# EAGLE design E500 (EAGLE 9.5.1)
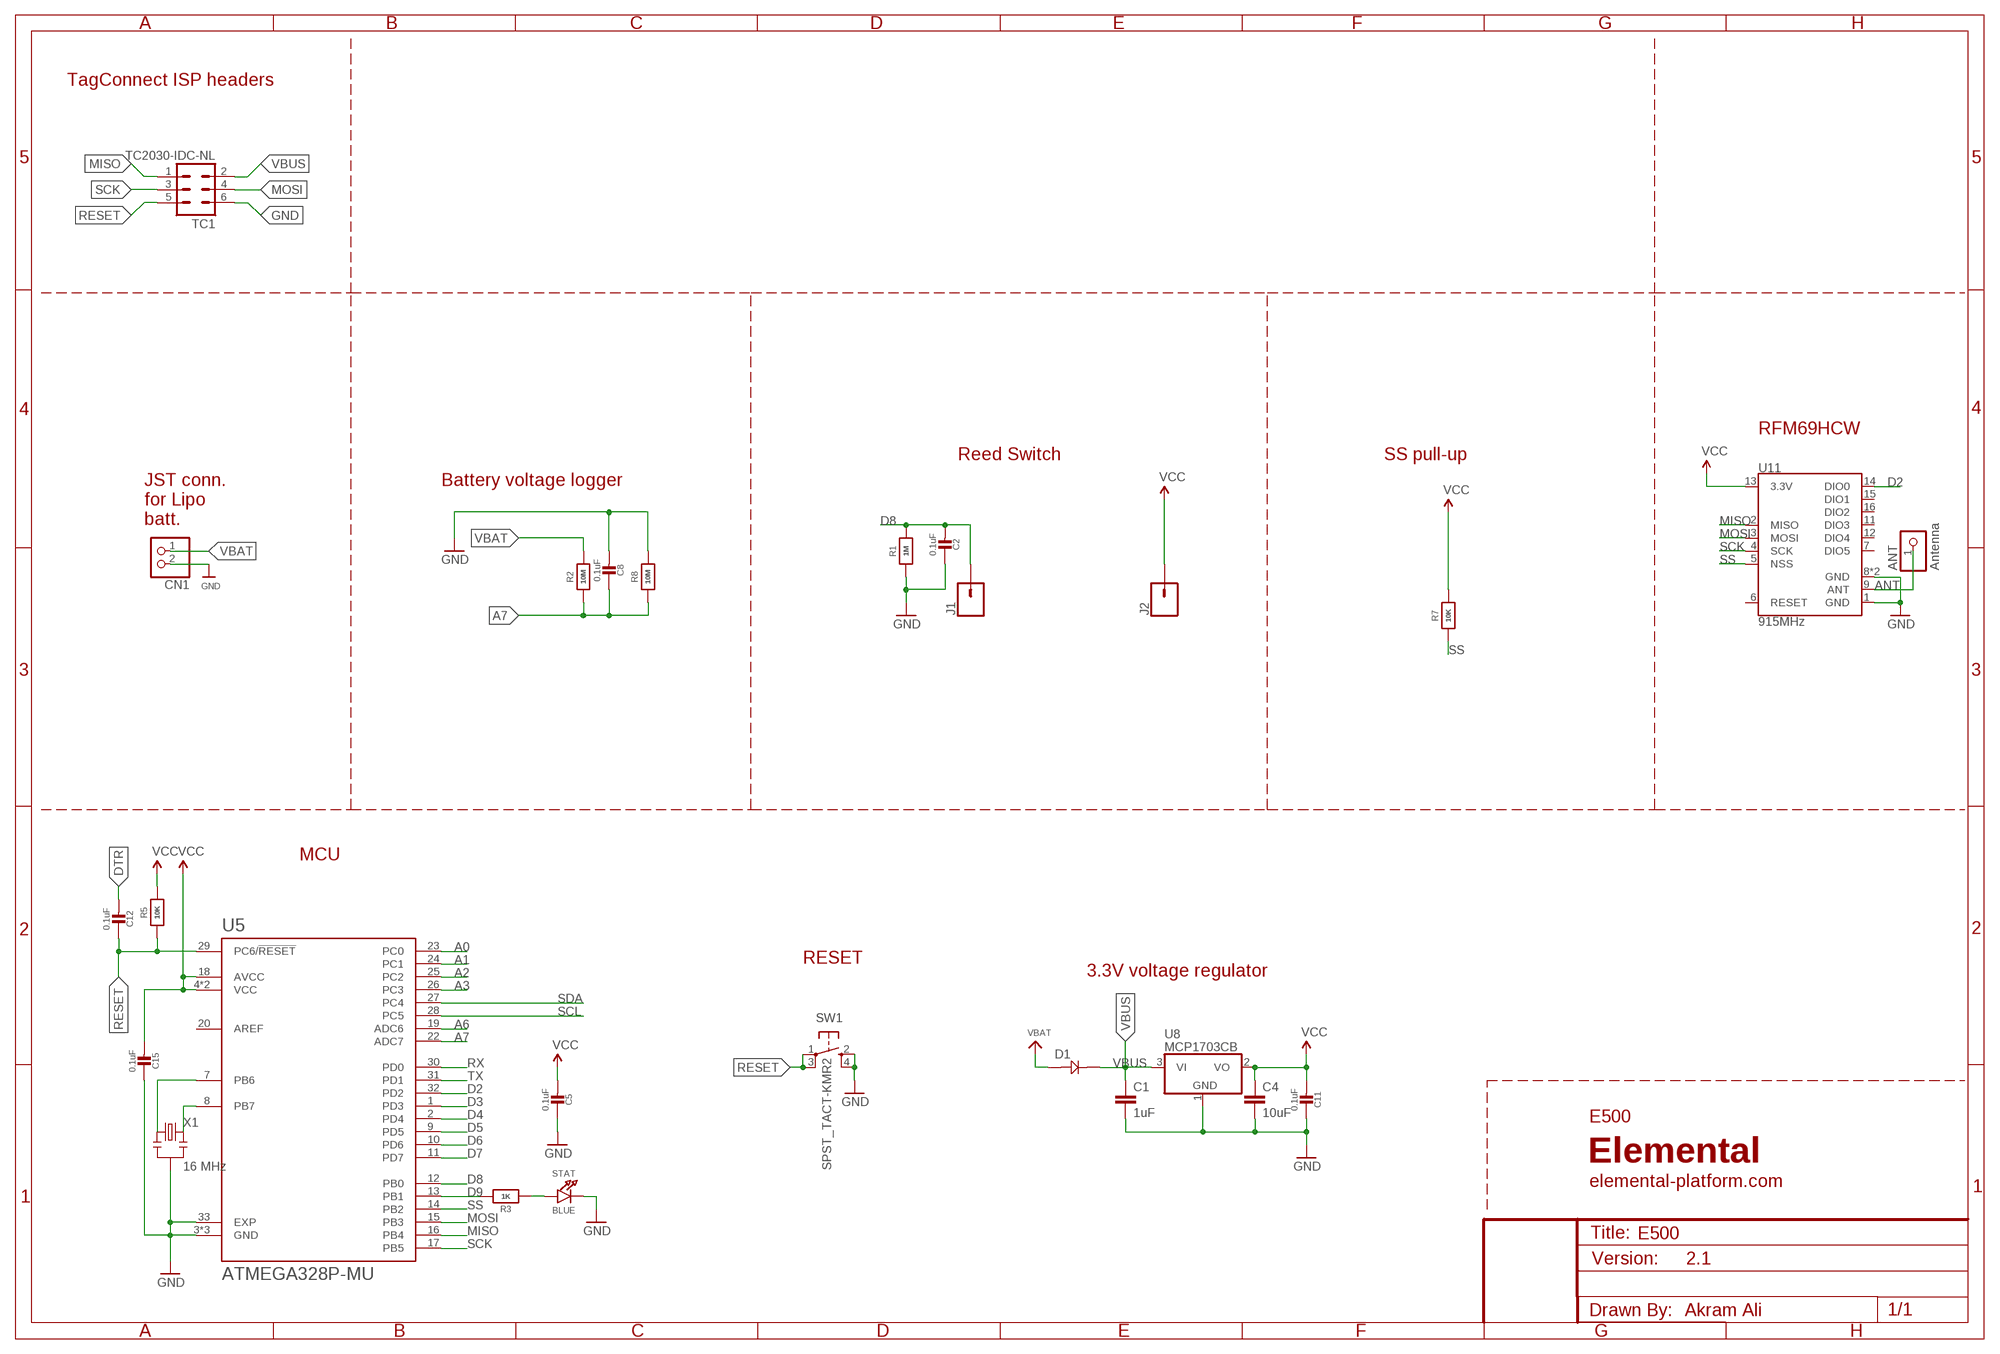
[diagram p0: schematic, sheet 1]

## Parts
ANT  Antenna  PINHD-1X1CB  [1X01-CLEANBIG]
C1  1uF  CAP0805  [0805]
C2  0.1uF  MICROBUILDER_CAP_CERAMIC_0402MP  [MICROBUILDER__0402MP]
C4  10uF  CAP0805  [0805]
C5  0.1uF  MICROBUILDER_CAP_CERAMIC_0402MP  [MICROBUILDER__0402MP]
C8  0.1uF  MICROBUILDER_CAP_CERAMIC_0402MP  [MICROBUILDER__0402MP]
C11  0.1uF  MICROBUILDER_CAP_CERAMIC_0402MP  [MICROBUILDER__0402MP]
C12  0.1uF  MICROBUILDER_CAP_CERAMIC_0402MP  [MICROBUILDER__0402MP]
C15  0.1uF  MICROBUILDER_CAP_CERAMIC_0402MP  [MICROBUILDER__0402MP]
CN1  JST_2PIN-SMT-RA  [JST-PH-2-SMT-RA]
D1  DIODE_SCHOTTKY0805-RES  [0805]
J1  CONN_01  [1X01]
J2  CONN_01  [1X01]
R1  1M  MICROBUILDER_RESISTOR_0402MP  [MICROBUILDER__0402MP]
R2  10M  MICROBUILDER_RESISTOR_0402MP  [MICROBUILDER__0402MP]
R3  1K  MICROBUILDER_RESISTOR_0402MP  [MICROBUILDER__0402MP]
R5  10K  MICROBUILDER_RESISTOR_0402MP  [MICROBUILDER__0402MP]
R7  10K  MICROBUILDER_RESISTOR_0402MP  [MICROBUILDER__0402MP]
R8  10M  MICROBUILDER_RESISTOR_0402MP  [MICROBUILDER__0402MP]
STAT  BLUE  LED0805_NOOUTLINE  [CHIPLED_0805_NOOUTLINE]
SW1  SPST_TACT-KMR2  [KMR2]
TC1  TC2030-IDC-NL  [TC2030-IDC-NL]
U5  ATMEGA328P-MU  [QFN50P500X500X100-33N]
U8  MCP1703CB  [SOT23]
U11  915MHz  RFM69HCW-915  [RFM69HCW-XXXS2]
X1  16 MHz  RESONATORSMD  [RESONATOR-SMD]

## Nets
A0: U5.23(PC0)
A1: U5.24(PC1)
A2: U5.25(PC2)
A3: U5.26(PC3)
A6: U5.19(ADC6)
A7: C8.1 R2.1 R8.1 U5.22(ADC7)
ANT: ANT.1 U11.9(ANT)
D2: U5.32(PD2) U11.14(DIO0)
D3: U5.1(PD3)
D4: U5.2(PD4)
D5: U5.9(PD5)
D6: U5.10(PD6)
D7: U5.11(PD7)
D8: C2.2 J1.1 R1.2 U5.12(PB0)
D9: R3.2 U5.13(PB1)
DTR: C12.2
GND: C1.2 C2.1 C4.2 C5.1 C8.2 C11.1 C15.1 CN1.2 R1.1 R8.2 STAT.C SW1.2(S) SW1.4(S1) TC1.6 U5.3(GND) U5.5(GND) U5.21(GND) U5.33(EXP) U8.1(GND) U11.1(GND) U11.8(GND) U11.10(GND) X1.2
MISO: TC1.1 U5.16(PB4) U11.2(MISO)
MOSI: TC1.4 U5.15(PB3) U11.3(MOSI)
N$4: U5.8(PB7) X1.3
N$5: U5.7(PB6) X1.1
N$8: R3.1 STAT.A
RESET: C12.1 R5.1 SW1.1(P) SW1.3(P1) TC1.5 U5.29(PC6/!RESET)
RX: U5.30(PD0)
SCK: TC1.3 U5.17(PB5) U11.4(SCK)
SCL: U5.28(PC5)
SDA: U5.27(PC4)
SS: R7.1 U5.14(PB2) U11.5(NSS)
TX: U5.31(PD1)
VBAT: CN1.1 D1.1 R2.2
VBUS: C1.1 D1.2 TC1.2 U8.3(VI)
VCC: C4.1 C5.2 C11.2 C15.2 J2.1 R5.2 R7.2 U5.4(VCC) U5.6(VCC) U5.18(AVCC) U8.2(VO) U11.13(3.3V)
Unconnected: U5.20(AREF) U11.6(RESET) U11.7(DIO5) U11.11(DIO3) U11.12(DIO4) U11.15(DIO1) U11.16(DIO2)

## Notes on the sheet
- TagConnect ISP headers
- RFM69HCW
- Reed Switch | SS pull-up
- Battery voltage logger
- JST conn.
  for Lipo
  batt.
- MCU
- RESET
- 3.3V voltage regulator
- E500
- Elemental
- elemental-platform.com
- 2.1
- Akram Ali

## Library data of the parts
ANT = adafruit@1:PINHD-1X1: Pin header 1x1 for 0.1" spacing With round pins; MPN: Helical antenna
C1 = SparkFun-Capacitors:CAP: Capacitor Standard 0603 ceramic capacitor, and 0.1" leaded capacitor.; MPN: CC0805ZRY5V8BB105
C2 C5 C8 C11 C12 C15 = Adafruit Feather 32u4 Bluefruit LE:MICROBUILDER_CAP_CERAMIC: Ceramic Capacitors For new designs, use the packages preceded by an '_' character since they are more reliable: The following footprints should be used on most boards: _0402 - Standard footprint for regular board layouts _0603 - Standard footprint for regular board layouts _0805 - Standard footprint for regular board layouts _1206 - Standard footprint for regular board layouts For extremely tight-pitch boards where space is at a premium, the following 'micro-pitch' footprints can be used (smaller pads, no silkscreen outline, etc.): _0402MP - Micro-pitch footprint for very dense/compact boards _0603MP - Micro-pitch footprint for very dense/compact boards _0805MP - Micro-pitch footprint for very dense/compact boards _1206MP - Micro-pitch footprint for very dense/compact boards; MPN: GRM155R71C104KA88J
C4 = SparkFun-Capacitors:CAP: Capacitor Standard 0603 ceramic capacitor, and 0.1" leaded capacitor.; MPN: CC0805KKX5R6BB106
CN1 = adafruit:JST_2PIN: JST 2-Pin Connectors of various flavors SMT-RA (S2B-PH-SM4) 4UConnector #17311 SMT (B2B-PH-SM4) THM-RA (S2B-PH) THM (B2B-PH)
D1 = SCHOTTKY_0805:DIODE_SCHOTTKY
J1 J2 = SparkFun-Connectors:CONN_01: Single connection point. Often used as Generic Header-pin footprint for 0.1 inch spaced/style header connections On any of the 0.1 inch spaced packages, you can populate with these: Break Away Headers - Straight <https://www.sparkfun.com/products/116> (PRT-00116) Break Away Male Headers - Right Angle <https://www.sparkfun.com/products/553> (PRT-00553) Female Headers <https://www.sparkfun.com/products/115> (PRT-00115) Break Away Headers - Machine Pin <https://www.sparkfun.com/products/117> (PRT-00117) Break Away Female Headers - Swiss Machine Pin <https://www.sparkfun.com/products/743> (PRT-00743) This device is also useful as a general connection point to wire up your design to another part of your project. Our various solder wires solder well into these plated through hole pads. Hook-Up Wire - Assortment (Stranded, 22 AWG) <https://www.sparkfun.com/products/11375> (PRT-11375) Hook-Up Wire - Assortment (Solid Core, 22 AWG) <https://www.sparkfun.com/products/11367> (PRT-11367) View the entire wire category on our website here <https://www.sparkfun.com/categories/141> Special notes: SMTSO-256-ET is a "flush mount" nut for a 4-40 screw. We mostly use this on specialty testbeds; it is a nice way to connect hardware to your PCB at an adjustable hieght. Also note, the SNAP packages are for using a snappable style connector. We sell a baggie of snaps and they are also used on two LilyPad designs: Snap Assortment - 30 pack (male and female) <https://www.sparkfun.com/products/11347> (DEV-11347) LilyPad Arduino SimpleSnap <https://www.sparkfun.com/products/10941> (DEV-10941) LilyPad SimpleSnap Protoboard <https://www.sparkfun.com/products/10940> (DEV-10940)
R1-R3 R5 R7 R8 = Adafruit Feather 32u4 Bluefruit LE:MICROBUILDER_RESISTOR: Resistors For new designs, use the packages preceded by an '_' character since they are more reliable: The following footprints should be used on most boards: _0402 - Standard footprint for regular board layouts _0603 - Standard footprint for regular board layouts _0805 - Standard footprint for regular board layouts _1206 - Standard footprint for regular board layouts For extremely tight-pitch boards where space is at a premium, the following 'micro-pitch' footprints can be used (smaller pads, no silkscreen outline, etc.): _0402MP - Micro-pitch footprint for very dense/compact boards _0603MP - Micro-pitch footprint for very dense/compact boards _0805MP - Micro-pitch footprint for very dense/compact boards _1206MP - Micro-pitch footprint for very dense/compact boards; MPN: RC0402JR-0710KL
STAT = microbuilder:LED: LED 0603 - 0603 Surface Mount Package 2mA: Green LED - Low Power (3.9mcd, 2ma, 1.7Vf) - Digikey: 475-2709-2-ND Orange LED - Low Power (9.8mcd, 2ma, 1.8Vf) - Digikey: 475-1194-2-ND Red LED - Low Power (5mcd, 2ma, 1.8Vf) - Digikey: 475-1195-2-ND Yellow LED - Low Power (7mcd, 2ma, 1.8Vf) - Digikey: 475-1196-2-ND 5mA: Blue LED - Low Power (17mcd, 5ma, 2.9Vf) - Digikey: LNJ937W8CRACT-ND 0805 - 0805 Surface Mount Package 2mA: Red LED (8.8mcd, 2mA, 1.8Vf, Clear) - Low Power [Digikey: 475-2510-1-ND] Green LED (5mcd, 2mA, 1.8Vf, Clear) - Low Power [Digikey: 475-2730-1-ND] Yellow LED (11.3mcd, 2mA, 1.8Vf, Clear) - Low Power [Digikey: 475-2555-1-ND] 20mA: Red LED (104mcd, 20mA, Diffused) - LS R976 [Digikey: 475-1278-6-ND] Red LED (12mcd, 20mA, 2.0Vf, Clear) - APT2012EC [Digikey: 754-1128-1-ND] Green LED (15mcd, 20mA, 2.2Vf, Clear) - APT2012GC [Digikey: 754-1131-1-ND] Orange LED (160mcd, 20mA, 2.1Vf, Clear) - APT2012SECK [Digikey: 754-1130-1-ND] 1206 - 1206 Surface Mount Package Green LED (26mcd, 20mA, Diffused) - LG N971 [Digikey: 475-1407-6-ND] Red LED (15mcd, 20mA, Diffused) - LH N974 [Digikey: 475-1416-6-ND] Cree - Cree High-Power Surface Mount LEDs XPEBWT-L1-0000-00D50 - White 111lm 350mA 2.9Vf 6200K 110° XTEAWT-00-0000-00000LEE3 - White 114lm 350mA 2.85Vf 5000K 115° Everlight - Everlight 45-21 Series Surface Mount LEDs 45-21/QK2C-B2832AC2CB2/2T - Warm White 2000mcd 20mA 3.25Vf 3050K 120° 45-21/LK2C-B38452C4CB2/2T - Nuetral White 2000mcd 20mA 3.25Vf 4150K 120° 45-21/LK2C-B50634C6CB2/2T - Cold White 2200mcd 20mA 3.25Vf 5650K 120° PLCC2 Reverse Mount LS T77K-J1L2-1-0-2-R18-Z - Red 11.25mcd 2mA 1.8Vf 630nm 120° LO T77K-L1M2-24-Z - Orange 19.6mcd 2mA 1.8Vf 606nm 120° LY T77K-K2M1-26-Z - Yellow 15.7mcd 2mA 1.8Vf 587nm 120°
SW1 = adafruit:SPST_TACT: SMT 6mm switch, EVQQ2 series http://www.ladyada.net/library/eagle
TC1 = TagConnect:TC2030-IDC: Tag-Connect In Circuit Programming & Debug Cable 6 Pin http://www.tag-connect.com
U5 = ATMEGA328P-MU:ATMEGA328P-MU: ATmega Series 20 MHz 32 KB Flash 2 KB SRAM 8-Bit Microcontroller - QFN-32; AVAILABILITY: Good; DESCRIPTION: ATmega Series 20 MHz 32 KB Flash 2 KB SRAM 8-Bit Microcontroller - QFN-32; MF: Atmel; MP: ATMEGA328P-MU; MPN: ATMEGA328P-MU; PACKAGE: QFN-32 Atmel; PRICE: 2.55 USD
U8 = linear:MCP1703: 250 mA, 16V, Low Quiescent Current LDO Regulator Source: http://ww1.microchip.com/downloads/en/DeviceDoc/22049b.pdf; MPN: MCP1703T-3302E/CB; OC_NEWARK: 18T9177
U11 = SparkFun-RF:RFM69H: Hope RF RFM69H ISM Transceiver Module The RFM69H is a transceiver module capable of operation over a wide frequency range, including the 315,433,868 and 915MHz license-free ISM (Industry Scientific and Medical) frequency bands. All major RF communication parameters are programmable and most of them can be dynamically set. The RFM69H offers the unique advantage of programmable narrow-band and wide- band communication modes. The RFM69H is optimized for low power consumption while offering high RF output power and channelized operation.Compliance ETSI and FCC regulations. Datasheet <http://www.hoperf.cn/upload/docs/RF/SX/RFM69H_DataSheet_v1.3.pdf> SparkFun Products RFM69HCW Wireless Transceiver - 915MHz <https://www.sparkfun.com/products/13909> (COM-13909) RFM69HCW Wireless Transceiver - 434MHz <https://www.sparkfun.com/products/13910> (COM-13910) SparkFun RFM69 Breakout (915MHz) <https://www.sparkfun.com/products/12775> (WRL-12775) SparkFun RFM69 Breakout (434MHz) <https://www.sparkfun.com/products/12823> (WRL-12823); MPN: RFM69HCW; PROD_ID: IC-11997
X1 = SparkFun:RESONATOR: Resonator Small SMD resonator. This is the itty bitty 10/20MHz resonators with built in caps. CSTCE10M0G55 and CSTCE20M0V53. Footprint has been reviewed closely but hasn't been tested yet.; MPN: CSTCE16M0V53-R0

## Net classes
1 power: width 0.381 mm, clearance 0.254 mm

## Board
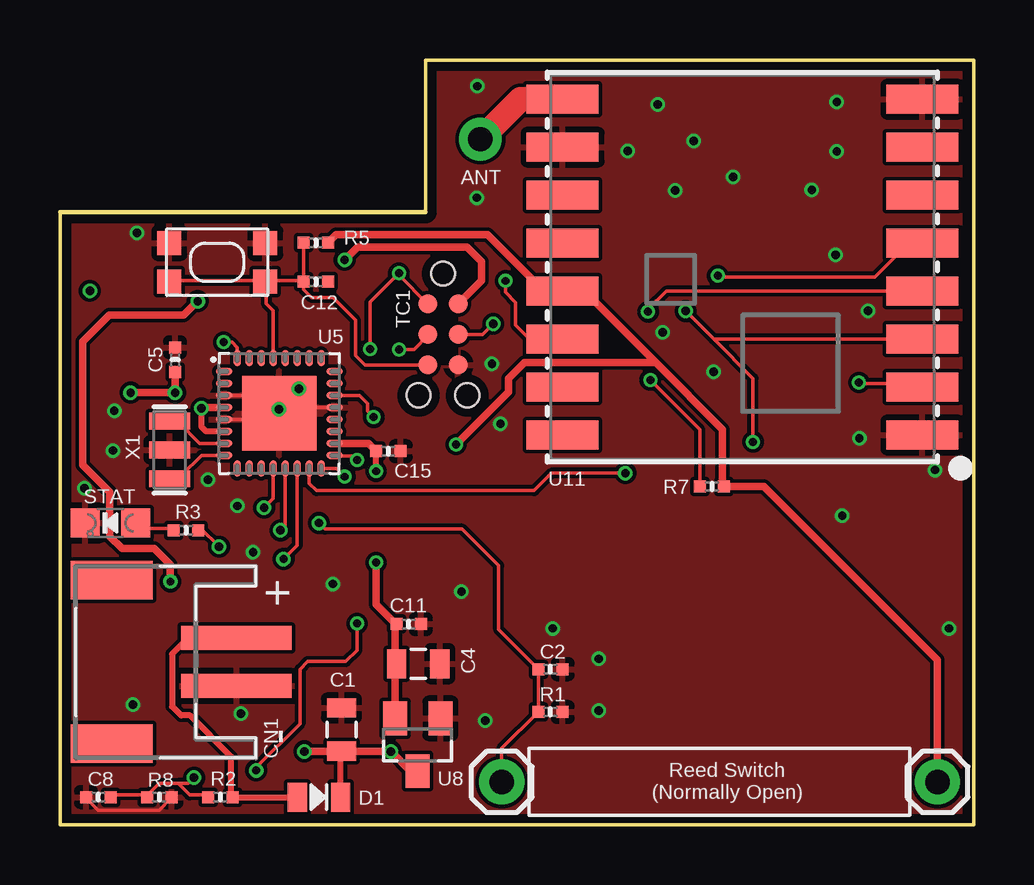
[diagram p1: board, top side]
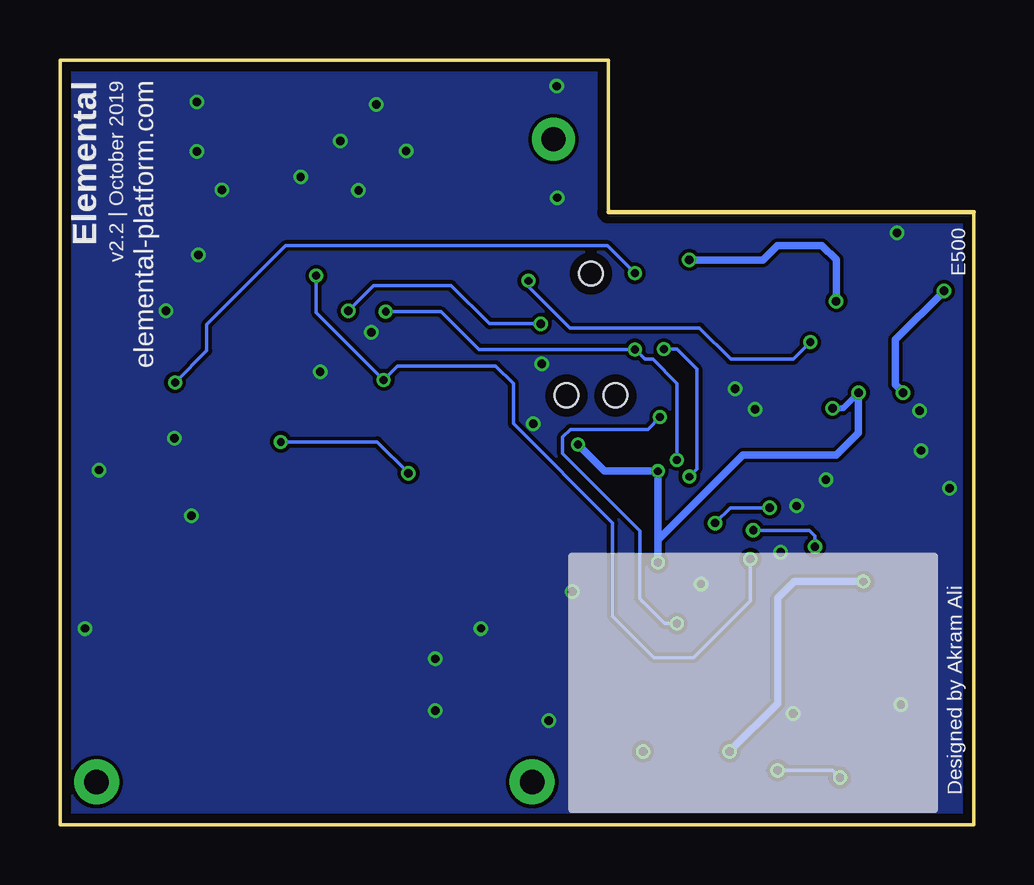
[diagram p2: board, bottom side, seen from below]

Size 38.1 x 31.88 mm. Coordinates in mm from the lower left corner, seen from the top.
Outline: 0,25.53 15.24,25.53 15.24,31.88 38.1,31.88 38.1,0 0,0 0,25.53
Copper layers (1*16): Top 0.035559375mm / dielectric 1.6mm / Bottom 0.035559375mm
Design rules "oshpark-2layer *": minimum track width 6mil, minimum drill 10mil, track to track 6mil, track to pad 6mil, pad to pad 6mil, via to via 6mil, smd to smd 6mil, copper to edge 15mil, drill to drill 6mil, minimum pad ring 5mil, minimum via ring 5mil, stop-mask expansion 2.5mil, vias tented up to drill 14mil, thermal gap 10mil

### Footprints (pad centres in the part's own frame; a part is rotated, then mirrored left to right if it is on the bottom)
1X01-CLEANBIG = drill 1.016 pad 1.778: 1 0,0
0805 = smd 0.8 x 1.2: 1 -0.9,0; 2 0.9,0
MICROBUILDER__0402MP = smd 0.5 x 0.5: 1 -0.508,0; 2 0.508,0
JST-PH-2-SMT-RA = smd 1 x 4.6: 1 1,-3.7; 2 -1,-3.7 | smd 1.6 x 3.4: NC1 -3.4,1.5; NC2 3.4,1.5
1X01 = drill 1.016 pad 1.88: 1 0,0
CHIPLED_0805_NOOUTLINE = smd 1.2 x 1.2: A 0,-1.05; C 0,1.05
KMR2 = smd 1 x 1: 1 2,0.8; 2 2,-0.8; 3 -2,0.8; 4 -2,-0.8
TC2030-IDC-NL = smd 0.787 x 0.787: 1 -1.27,-0.635; 2 -1.27,0.635; 3 0,-0.635; 4 0,0.635; 5 1.27,-0.635; 6 1.27,0.635 | hole 0.991: -2.54,0; 2.54,1.016; 2.54,-1.016
QFN50P500X500X100-33N = smd 0.7 x 0.3: 1 -2.3,1.75; 2 -2.3,1.25; 3 -2.3,0.75; 4 -2.3,0.25; 5 -2.3,-0.25; 6 -2.3,-0.75; 7 -2.3,-1.25; 8 -2.3,-1.75; 17 2.3,-1.75; 18 2.3,-1.25; 19 2.3,-0.75; 20 2.3,-0.25; 21 2.3,0.25; 22 2.3,0.75; 23 2.3,1.25; 24 2.3,1.75 | smd 0.3 x 0.7: 9 -1.75,-2.3; 10 -1.25,-2.3; 11 -0.75,-2.3; 12 -0.25,-2.3; 13 0.25,-2.3; 14 0.75,-2.3; 15 1.25,-2.3; 16 1.75,-2.3; 25 1.75,2.3; 26 1.25,2.3; 27 0.75,2.3; 28 0.25,2.3; 29 -0.25,2.3; 30 -0.75,2.3; 31 -1.25,2.3; 32 -1.75,2.3 | smd 3.1 x 3.1: 33 0,0
SOT23 = smd 1 x 1.4: 1 -0.95,-1.1; 2 0.95,-1.1; 3 0,1.1
RFM69HCW-XXXS2 = smd 3 x 1.2: 1 -7.5,7; 2 -7.5,5; 3 -7.5,3; 4 -7.5,1; 5 -7.5,-1; 6 -7.5,-3; 7 -7.5,-5; 8 -7.5,-7; 9 7.5,-7; 10 7.5,-5; 11 7.5,-3; 12 7.5,-1; 13 7.5,1; 14 7.5,3; 15 7.5,5; 16 7.5,7
RESONATOR-SMD = smd 0.7 x 1.7: 1 -1.2,0; 2 0,0; 3 1.2,0

### Placement (x,y rotation side)
ANT  17.53,28.57 0 top
C1  11.73,3.96 90 top
C2  20.45,6.48 180 top
C4  14.94,6.71 0 top
C5  4.8,19.38 270 top
C8  1.6,1.14 180 top
C11  14.54,8.36 180 top
C12  10.67,22.63 0 top
C15  13.69,15.57 180 top
CN1  3.66,6.78 90 top
D1  10.79,1.14 0 top
J1  18.41,1.78 0 top
J2  36.58,1.78 0 top
R1  20.45,4.7 180 top
R2  6.68,1.14 0 top
R3  5.26,12.27 0 top
R5  10.67,24.26 0 top
R7  27.18,14.1 0 top
R8  4.14,1.14 0 top
STAT  2.11,12.57 90 top
SW1  6.55,23.44 180 top
TC1  15.96,20.43 270 top
U5  9.14,17.15 0 top
U8  14.91,3.33 180 top
U11  28.45,23.24 180 top
X1  4.57,15.62 270 top

### Tracks (layer width: path | path; a pad name or v marks a point on that pad's centre or on a via)
A7  (via drill 0.33, 0.35)
  Top 0.152: C8.1 2.22,1.24 3.49,1.24 R8.1 3.65,1.24 4.13,1.71 4.92,1.71 | 4.92,1.71 5.4,1.24 6.08,1.24 R2.1 | v12.38,8.38 12.38,7.27 11.91,6.79 10.32,6.79 10,6.48 10,4.21 8.18,2.39 v8.18,2.26 | U5.22 12.49,17.9 12.83,17.56 12.83,17.24 v13.08,16.99 | v5.59,1.96 5.35,1.71 4.92,1.71
  Bottom 0.152: v12.38,8.38 12.9,8.38 13.92,9.4 13.92,12.24 17.14,15.47 17.14,16.16 16.83,16.48 13.59,16.48 v13.08,16.99 | v8.18,2.26 5.89,2.26 v5.59,1.96
ANT
  Top 1.016: U11.9 19.19,30.24 ANT.1
D2  (via drill 0.33)
  Top 0.152: v18.57,22.67 18.57,22.19 19,21.77 19,20.83 19.54,20.29 20.8,20.29 U11.14 | U5.32 7.39,19.89 7.17,20.11 v6.82,20.11
  Bottom 0.152: v18.57,22.67 18.57,22.43 16.84,20.7 11.44,20.7 10.14,19.41 7.53,19.41 v6.82,20.11
D8  (via drill 0.35)
  Top 0.152: J1.1 18.41,3.17 R1.2 C2.2 18.29,8.13 18.29,10.8 16.76,12.32 11.05,12.32 v10.79,12.57 | U5.12 8.89,13.59 v8.51,13.21
  Bottom 0.152: v10.79,12.57 10.16,13.21 v8.51,13.21
D9  (via drill 0.35)
  Top 0.152: R3.2 5.87,12.35 v6.63,11.59 v6.63,11.58 | v9.2,12.27 9.39,12.47 U5.13
  Bottom 0.152: v9.2,12.27 6.86,12.27 6.63,12.04 v6.63,11.58
GND  (via drill 0.35)
  Top 0.152: U5.21 10.72,17.4 v9.96,18.16 | U5.5 8.69,16.9 v9.12,17.32 8.55,17.9 U5.3 | C8.2 1.11,1.08 1.59,0.6 4.13,0.6 4.6,1.08 R8.2
  other vias: 7.54,4.62 2.21,15.6 18.01,19.2 24.92,30.02 26.42,28.5 31.34,26.47 28.07,27 17.4,30.78 17.37,26.14 3.05,5 33.32,16.1 7.39,13.28 6.17,14.38 8.05,11.35 3.2,24.66 2.26,17.25 1.02,14.02 18.36,16.71 27.25,18.87 33.68,21.41 32.33,23.75 25.65,26.44 32.38,30.12 23.67,28.09 32.38,28.07 25.12,20.52 17.73,4.34 36.47,14.78 11.38,10.03 32.61,12.88 37.06,8.18 16.74,9.7 20.55,8.18 22.45,4.75 22.45,6.91
  pour Top (rank 6): 39.37,33.15 39.37,-1.27 -1.27,-1.27 -1.27,33.15
  pour Bottom: -1.52,33.4 39.62,33.4 39.62,-1.52 -1.52,-1.52
MISO  (via drill 0.33)
  Top 0.152: U11.2 35.88,18.38 33.35,18.38 v33.31,18.43 | U5.16 11.53,14.84 v11.87,14.5 | v12.92,19.82 12.92,21.78 v14.13,22.99 14.13,22.9 TC1.1
  Bottom 0.152: v33.31,18.43 31.98,19.76 31.98,20.85 28.7,24.13 15.27,24.13 v14.13,22.99 | v11.87,14.5 11.56,14.81 11.56,19 12.38,19.82 v12.92,19.82
MOSI  (via drill 0.33, 0.35)
  Top 0.152: v18.06,20.88 17.61,20.43 TC1.4 | v26.09,21.41 27.26,20.24 | v23.57,14.66 20.5,14.66 19.76,13.92 10.69,13.92 10.39,14.22 U5.15 | U11.3 27.26,20.24 | v28.89,15.96 28.89,18.6 27.26,20.24
  Bottom 0.152: v18.06,20.88 20.19,20.88 21.79,22.48 25.02,22.48 v26.09,21.41 | v23.57,14.66 24.87,15.96 v28.89,15.96
N$4
  Top 0.152: X1.3 4.6,14.57 5.08,14.57 5.9,15.4 U5.8
N$5
  Top 0.152: X1.1 4.6,16.8 4.92,16.8 5.82,15.9 U5.7
N$8
  Top 0.152: R3.1 4.6,12.35 3.33,12.35 3.17,12.51 STAT.A
RESET
  Top 0.152: 8.89,22.67 8.57,22.67 SW1.3 | 8.89,22.67 10.16,22.67 | 10.16,22.67 R5.1 | 10.16,22.67 C12.1 10.16,22.3 10.49,21.97 11.38,21.97 12.32,21.03 12.32,19.56 12.71,19.16 TC1.5 | 8.89,22.67 SW1.3 | SW1.1 4.6,22.67 8.41,22.67 SW1.3 | U5.29 8.89,21.43 8.6,21.73 8.6,22.6 SW1.3
SCK  (via drill 0.33)
  Top 0.152: v12.38,15.21 12.22,15.37 11.59,15.37 U5.17 | v14.13,19.81 14.76,19.81 15.33,20.38 TC1.3 | U11.4 25.28,22.24 24.52,21.48 v24.52,21.38
  Bottom 0.152: v24.52,21.38 22.21,21.38 20.64,19.81 v14.13,19.81 13.72,19.4 13.39,19.4 12.38,18.4 v12.38,15.21
SS  (via drill 0.33, 0.35)
  Top 0.152: v24.61,18.54 26.67,16.48 R7.1 | U11.5 35.88,24.1 35.24,24.1 33.97,22.83 27.47,22.83 v27.42,22.88 | U5.14 9.89,11.65 v9.32,11.07
  Bottom 0.152: v27.42,22.88 27.42,21.35 v24.61,18.54 24.02,19.13 19.94,19.13 19.2,18.39 19.2,16.71 15.06,12.57 15.06,8.68 13.34,6.95 11.68,6.95 9.32,9.31 v9.32,11.07
VBAT
  Top 0.254: CN1.1 5.34,7.78 4.67,7.11 4.67,4.93 5.05,4.55 5.42,4.55 7.14,2.83 7.14,1.24 R2.2 D1.1
VBUS  (via drill 0.33, 0.35)
  Top 0.254: C1.1 11.72,3.05 11.7,3.02 D1.2 | 13.78,3.06 v13.79,3.05 | U8.3 14.61,2.23
  Top 0.305: v11.87,23.54 12.4,24.08 16.97,24.08 17.58,23.47 17.58,22.68 TC1.2 | v5.74,21.82 5.16,21.23 2.06,21.23 0.95,20.13 0.95,15 2.08,13.87 2.08,12.01 2.59,11.51 3.94,11.51 4.6,10.84 v4.6,10.13 | v10.19,3.05 11.72,3.05 | C1.1 13.78,3.06 | 14.61,2.23 v13.79,3.05
  Bottom 0.305: v4.6,10.13 7.49,10.13 8.18,9.44 8.18,5.05 v10.19,3.05 | v11.87,23.54 8.79,23.54 8.19,24.14 6.34,24.14 5.74,23.55 v5.74,21.82
VCC  (via drill 0.33, 0.35)
  Top 0.152: 13.97,6.79 C4.1 13.96,6.63 | 13.97,8.38 C11.2 | 20.8,22.35 U11.13 20.95,22.19 | v13.18,14.73 v13.18,14.74 | 5.89,16.59 5.9,16.59
  Top 0.254: 13.97,8.22 C11.2 | v13.18,14.74 C15.2 | U5.6 6.08,16.4 5.89,16.59 | 5.9,16.59 v5.9,17.35 5.94,17.4
  Top 0.305: 13.97,6.79 13.97,8.22 | v13.18,10.92 13.18,9.18 13.97,8.38 | 24.85,19.25 21.91,22.19 20.95,22.19 | 24.85,19.25 27.62,16.48 27.62,14.16 R7.2 29.34,14.1 36.58,6.86 J2.1 | R5.2 11.51,24.59 17.83,24.59 20.07,22.35 20.8,22.35 | U5.18 12.86,15.9 C15.2 | C5.2 v4.8,18.01 v2.95,18.01 | U8.2 13.96,6.63 | v16.51,15.84 18.69,18.03 18.69,18.59 19.36,19.25 24.85,19.25 | U5.4 5.94,17.4
  Bottom 0.152: 4.83,17.98 v4.8,18.01
  Bottom 0.254: v4.8,18.01 5.46,17.35 v5.9,17.35
  Bottom 0.305: 13.18,11.87 v13.18,14.73 15.4,14.73 v16.51,15.84 | 13.18,11.87 9.63,15.42 5.74,15.42 4.83,16.33 4.83,17.98 | v1.25,22.25 3.28,20.22 3.28,18.34 v2.95,18.01 | v13.18,10.92 13.18,11.87

### Text on the board
_tsilk: Reed Switch / (Normally Open)
_bsilk: elemental-platform.com | v2.2 | October 2019 | Elemental | E500 | Designed by Akram Ali